# Altium schematic sheet Power.SchDoc
size A3; SheetNumber: 2; SheetTotal: 3
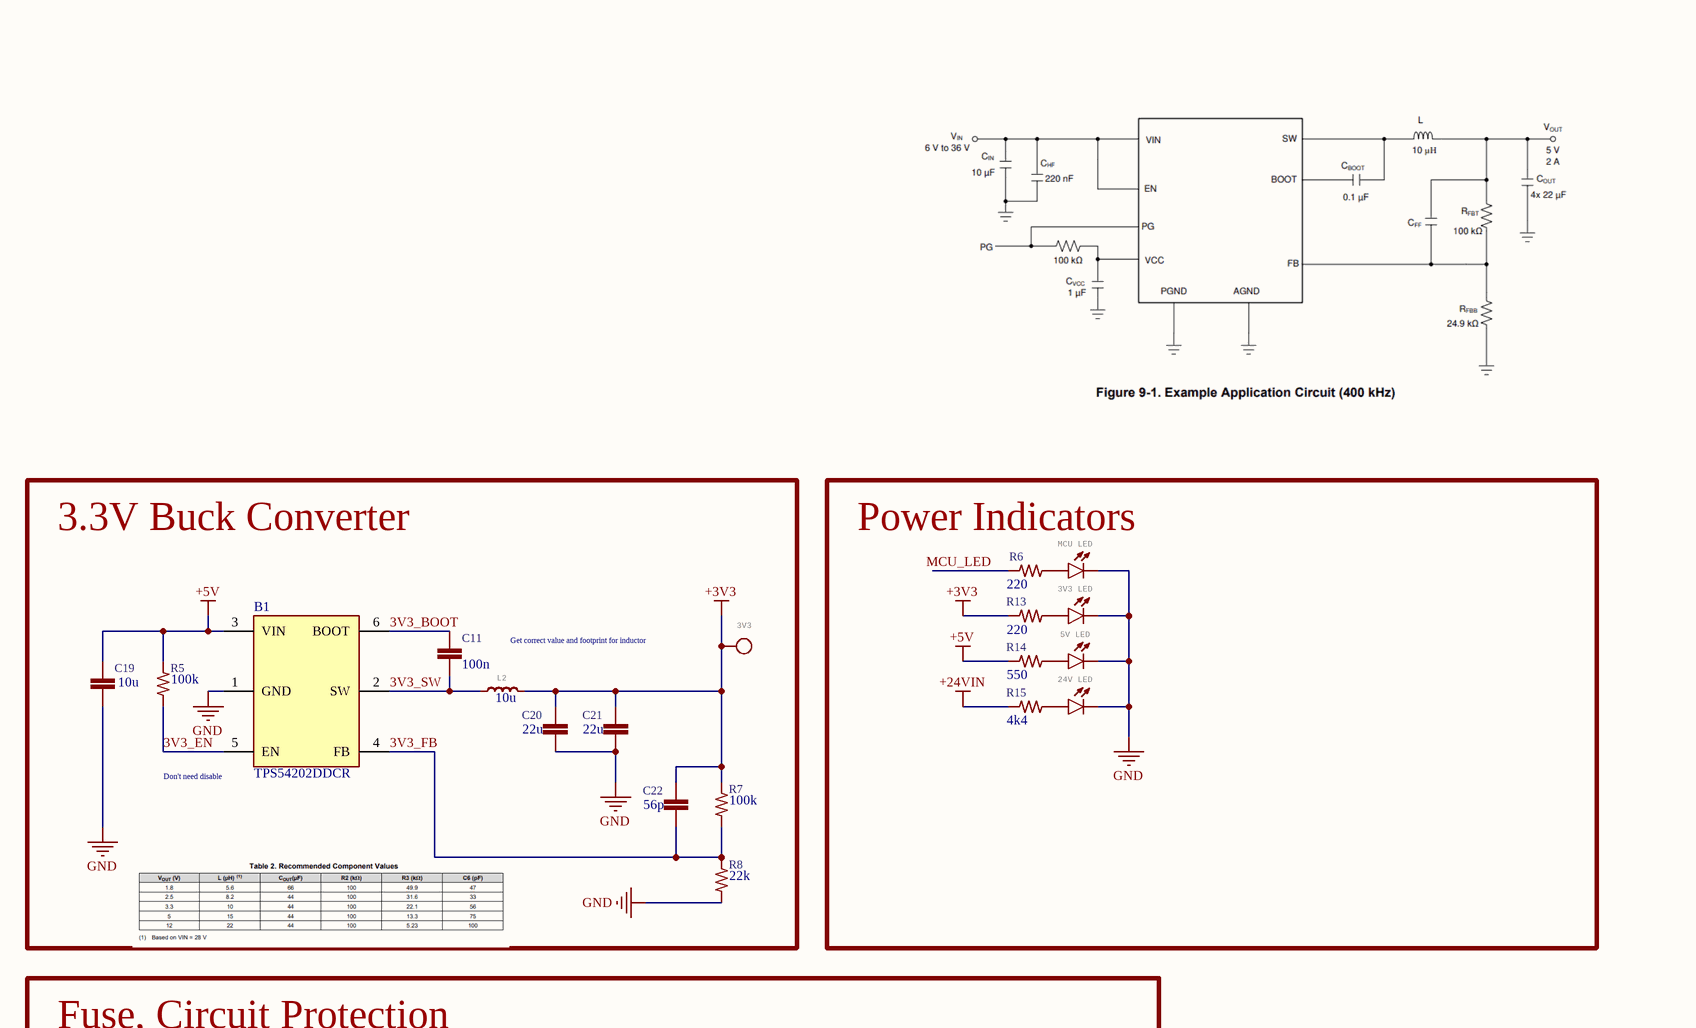
[diagram p0: Power.SchDoc, top middle]
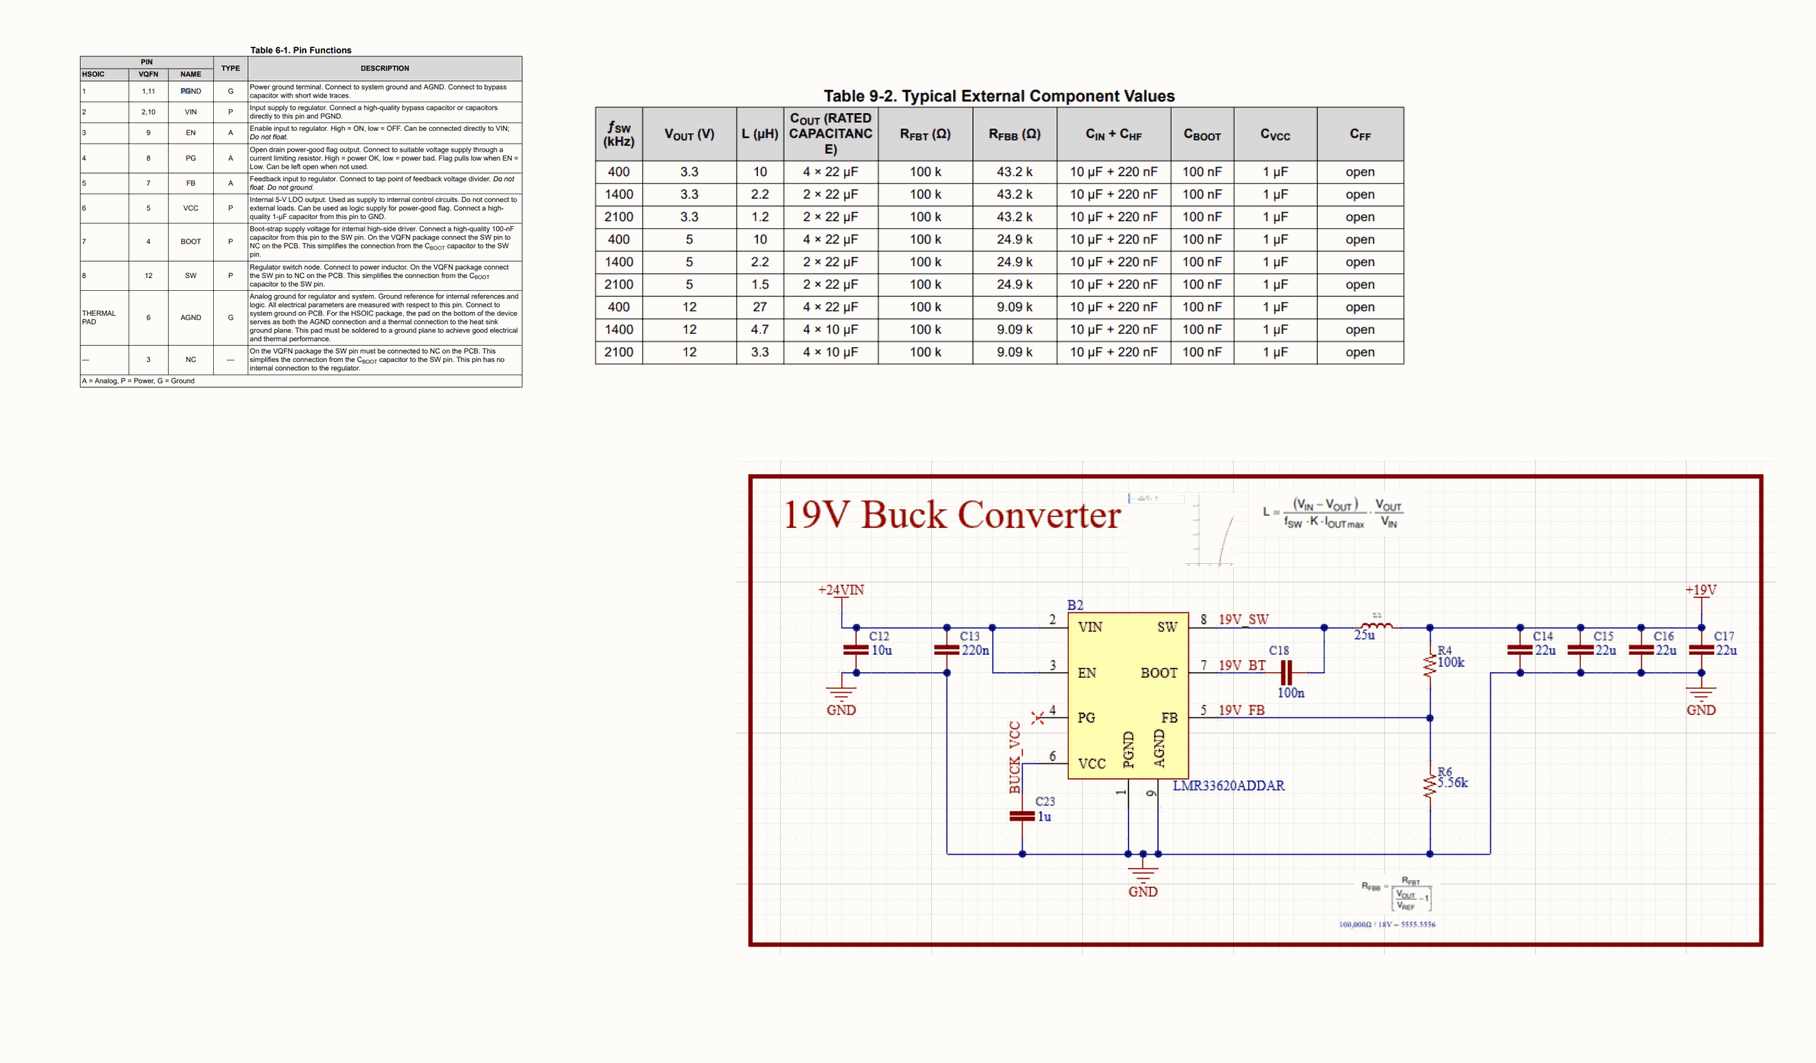
[diagram p1: Power.SchDoc, top right]
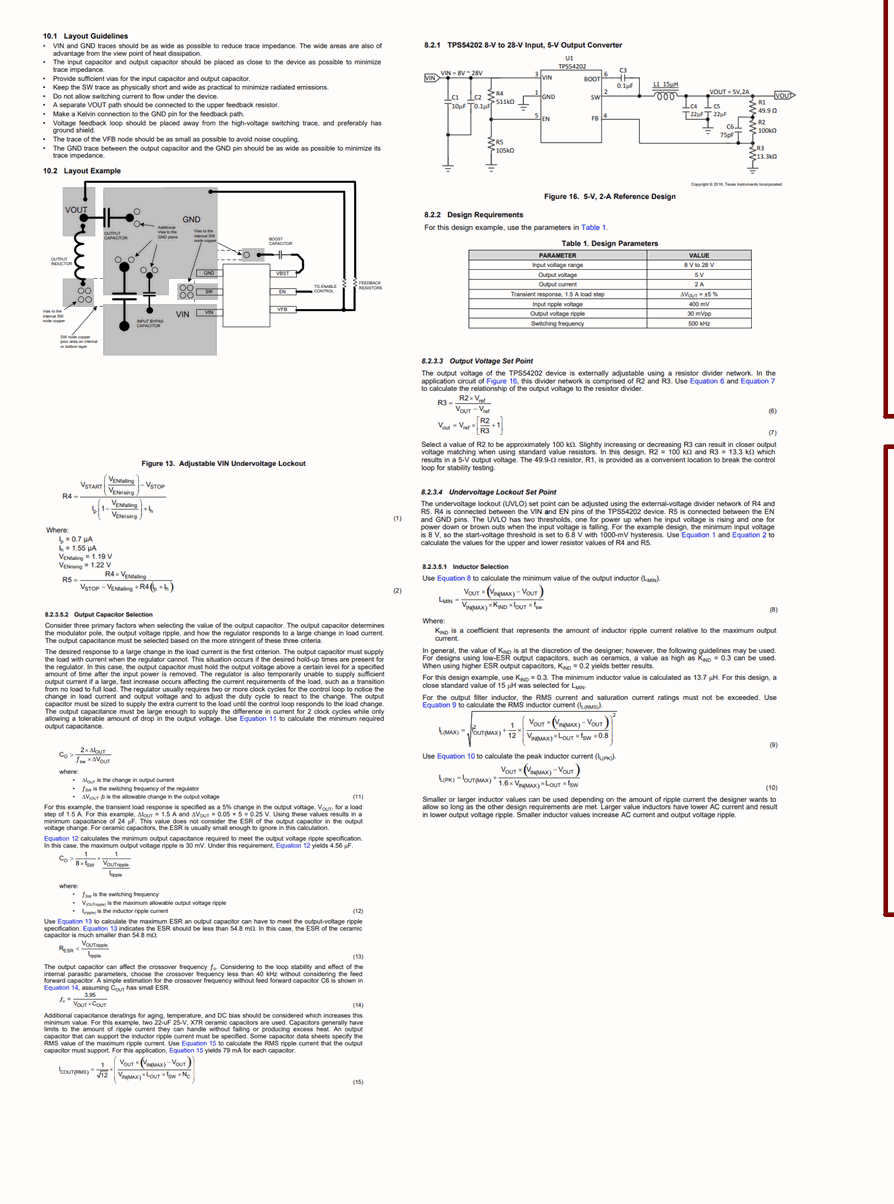
[diagram p2: Power.SchDoc, bottom left]
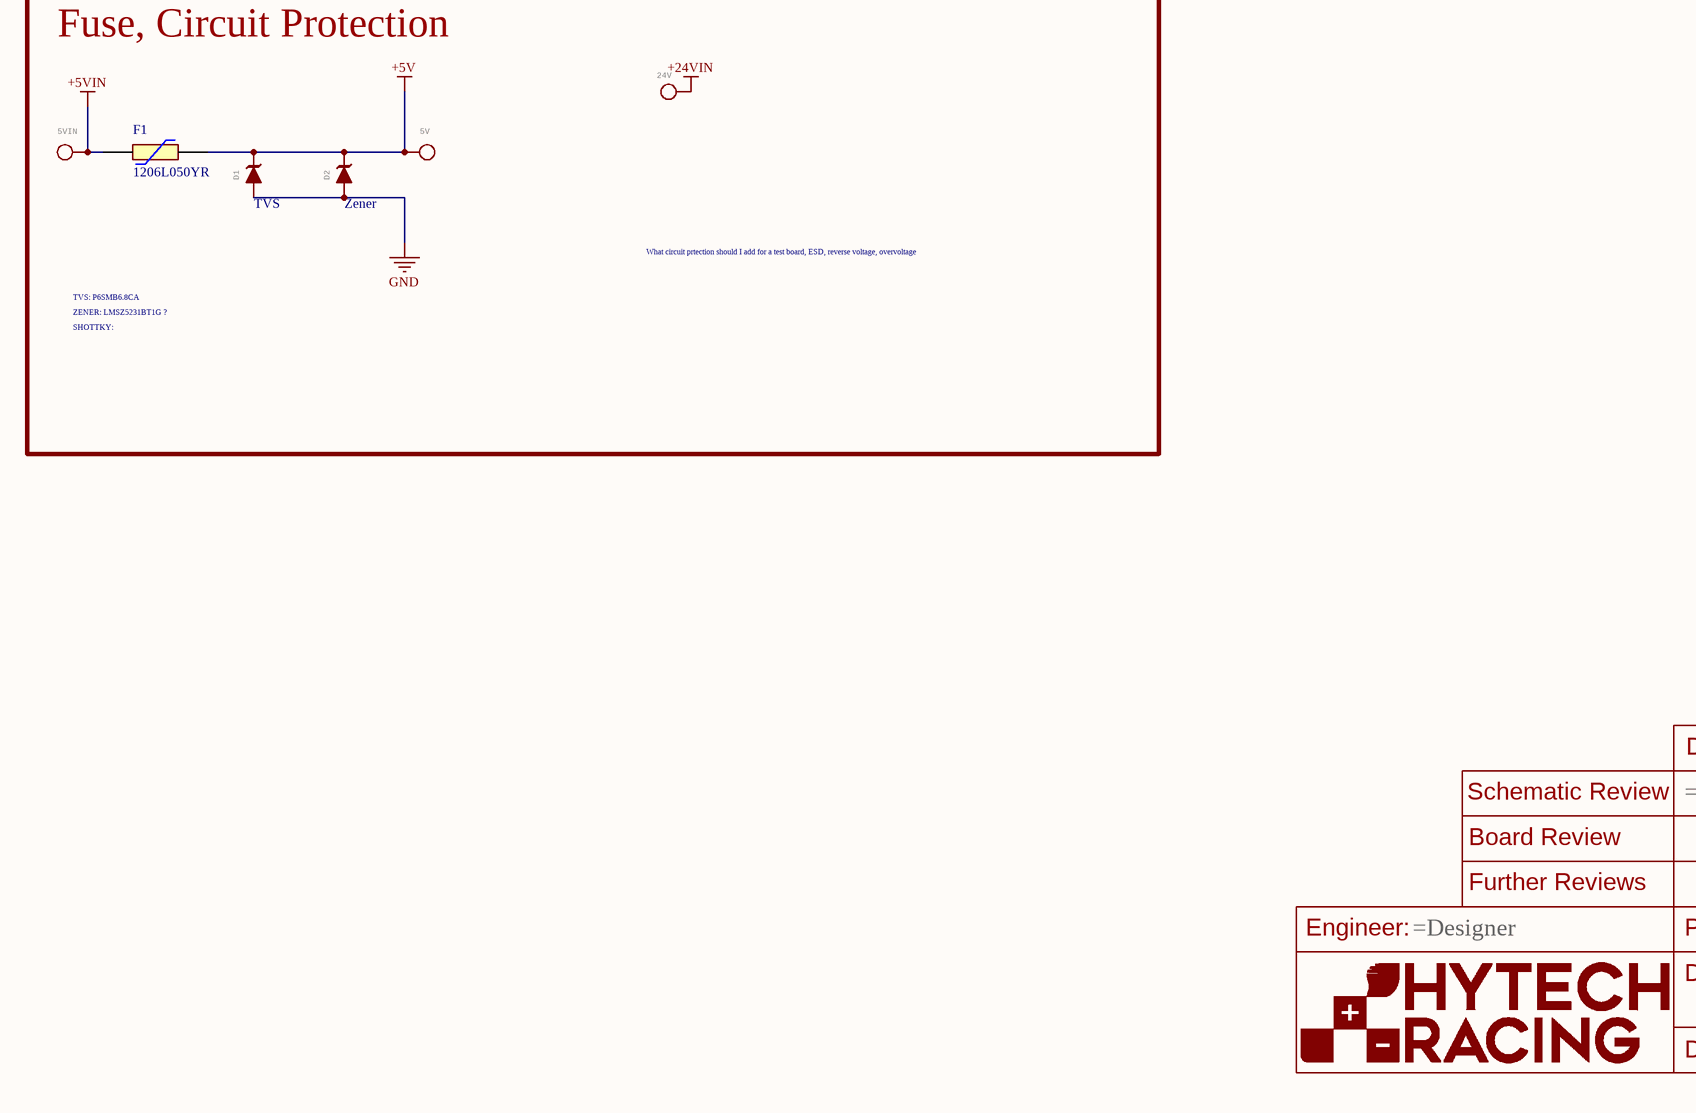
[diagram p3: Power.SchDoc, bottom middle]
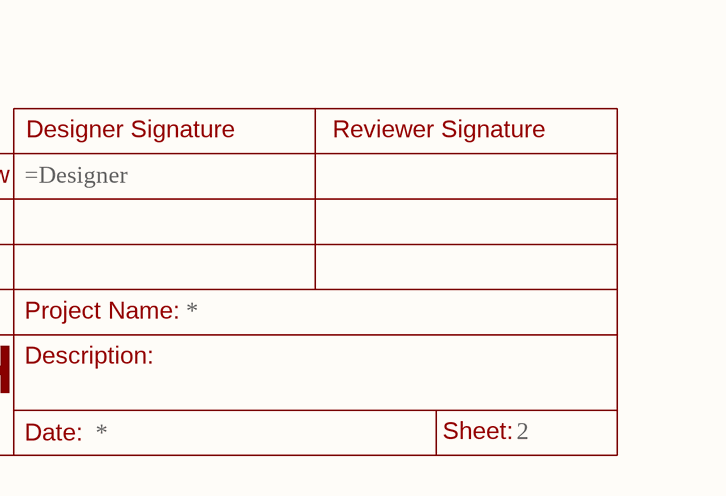
[diagram p4: Power.SchDoc, bottom right]

## Parts
3V3  Test Point for Probing  [5015]  (value not drawn)
3V3_LED  APT1608SGC  [0603-LED]  (value not drawn)
5V  Test Point for Probing  [5015]  (value not drawn)
5V_LED  APT1608SGC  [0603-LED]  (value not drawn)
5VIN  Test Point for Probing  [5015]  (value not drawn)
24V  Test Point for Probing  [5015]  (value not drawn)
24V_LED  APT1608SGC  [0603-LED]  (value not drawn)
B1  TPS54202DDCR  [SOT-23-6]
C11  100n  [0402_CAP]
C19  10u  [0805-CAP]
C20  22u  [1206-CAP]
C21  22u  [1206-CAP]
C22  56p  [1206-CAP]
D1  TVS  [DO-214AA]
D2  Zener  [DO-214AA]
F1  1206L050YR  [1206-FUSE]
FRAME2  HyTech Racing Frame (ANSI Size A)  Prints on US Letter Landscape 8.5" by 11"   Fill Engineer/Description Fields with Text using the following settings:  Size: 0.1  Ratio: 8%  Line Distance: 50%  Font: Proportional  Layer: 94 Symbol  (value not drawn)
L2  10u  [1210_IND]
MCU_LED  APT1608SGC  [0603-LED]  (value not drawn)
R5  100k  [0603-RES]
R6  220  [0603-RES]
R7  100k  [0603-RES]
R8  22k  [0603-RES]
R13  220  [0603-RES]
R14  550  [0603-RES]
R15  4k4  [0603-RES]

## Blocks framed on the sheet
3.3V Buck Converter: 3V3 B1 C11 C19-C22 L2 R5 R7 R8
Power Indicators: 3V3_LED 5V_LED 24V_LED MCU_LED R6 R13-R15
Fuse, Circuit Protection: 5V 5VIN 24V D1 D2 F1

## Nets
+3V3: 3V3.1 C20.1 C21.1 C22.1 L2.2 R7.1 R13.1
+5V: 5V.1 B1.3(VIN) C19.1 D1.2(C) D2.2(C) F1.2 R5.1 R14.1
+5VIN: 5VIN.1 F1.1
+24VIN: 24V.1 R15.1
GND: 3V3_LED.1(C) 5V_LED.1(C) 24V_LED.1(C) B1.1(GND) C19.2 C20.2 C21.2 D1.1(A) D2.1(A) MCU_LED.1(C) R8.2
3V3_BOOT: B1.6(BOOT) C11.2
3V3_EN: B1.5(EN) R5.2
3V3_FB: B1.4(FB) C22.2 R7.2 R8.1
3V3_SW: B1.2(SW) C11.1 L2.1
MCU_LED: R6.1
Net3V3_LED_2: 3V3_LED.2(A) R13.2
Net5V_LED_2: 5V_LED.2(A) R14.2
Net24V_LED_2: 24V_LED.2(A) R15.2
NetMCU_LED_2: MCU_LED.2(A) R6.2

## Notes on the sheet
- Get correct value and footprint for inductor
- (near B1) Don't need disable
- TVS: P6SMB6.8CA
- What circuit prtection should I add for a test board, ESD, reverse voltage, overvoltage
- ZENER: LMSZ5231BT1G ?
- SHOTTKY:
- (in symbol FRAME) Designer Signature; Reviewer Signature; Schematic Review; Board Review; Further Reviews; Engineer:; Project Name:; Description:; Date:; Sheet:

## Library data of the parts
3V3 5V 5VIN 24V = TEST_POINT: MANUFACTURER: Keystone Electronics; GateName_1: G$1; DKPN: 36-5015CT-ND; MOPN: 534-5015; SymbolName_1: TEST_POINT; LibraryName: HyTechDevices; DeviceSetName: TEST_POINT; Package: 5015; MPN: 5015
3V3_LED 5V_LED 24V_LED MCU_LED = LED_?_*0603: MANUFACTURER: Kingbright; MPN: APT1608VBC/D; MPN: APT1608ZGCK; MPN: APT1608SECK; MPN: APT1608SECK/J3-PRV; MANUFACTURER: Bivar Inc.; MPN: SM0603UWC; MPN: APT1608SYCK/J3-PRV; GateName_1: LED; SymbolName_1: DIODE_LED; DeviceName: 0603; DKPN: 754-1789-1-ND; MOPN: 604-APT1608VBC/D; DKPN: 754-1790-1-ND; MOPN: 604-APT1608ZGCK; DKPN: 754-1120-1-ND; MOPN: 604-APT1608SECK; DKPN: 754-1786-1-ND; MOPN: 604-APT1608SECKJ3PRV; DKPN: SM0603UWC-ND; MOPN: 749-SM0603UWC; DKPN: 754-1788-1-ND; MOPN: 604-APT1608SYCK/J3-PRV; LibraryName: HyTechDevices; DeviceSetName: LED_?_*; Package: 0603-LED; COLOR: Blue; COLOR: Green; COLOR: Orange; COLOR: Red; COLOR: White; COLOR: Yellow
B1 = TPS54202DDCR: 4.5V to 28V Input, 2A Output, EMI Friendly Synchronous Step-Down Converter; Manufacturer_Name: Texas Instruments; Geometry.Height: 1.1mm; Mouser Part Number: 595-TPS54202DDCR; Mouser Price/Stock: https://www.mouser.co.uk/ProductDetail/Texas-Instruments/TPS54202DDCR?qs=uP22XH7NdCsJtN%2Fq54jCtQ%3D%3D; Manufacturer_Part_Number: TPS54202DDCR; Datasheet Link: http://www.ti.com/lit/gpn/tps54202
C11 = CAPACITOR_?_*0402: MANUFACTURER: Yageo; MPN: CC0603KRX7R0BB104; MPN: CC0603KRX7R0BB103; MANUFACTURER: KEMET; MPN: C0603C823K8RACTU; MANUFACTURER: Vishay Vitramon; MPN: VJ0603Y104JXQPW1BC; MPN: VJ0603Y224JXQCW1BC; MPN: CC0603KRX7R6BB103; MPN: VJ0603A150FXQPW1BC; MPN: CC0603KRX7R6BB105; MANUFACTURER: Murata Electronics; MPN: GRM188R61A226ME15D; MANUFACTURER: Würth Elektronik; MPN: 885012006016; MPN: 885012206012; MANUFACTURER: Samsung Electro-Mechanics; MPN: CL10A475KP8NNNC; MPN: 885012006013; MPN: C0603C683K8RACTU; MANUFACTURER: Kyocera AVX; MPN: 0201ZA820JAT2A; MPN: CL10B104KA8NNNC; MANUFACTURER: Walsin Technology Corporation; MPN: 0603B224K250CT; MPN: CC0603KRX7R8BB122; MPN: GRM188R61E106MA73D; MPN: CL10B105KA8NNNC; MANUFACTURER: TDK Corporation; MPN: C1608X5R1E475K080AC; MPN: 06033C473K4Z2A; MANUFACTURER: Taiyo Yuden; MPN: GMK107B7104KAHT; MPN: C1608X7R1V224K080AB; MPN: C1608X7R1V105K080AE; MPN: CC0603KRX7R9BB104; MPN: C1608C0G1H103J080AA; MPN: UMK107BJ105KA-T; MPN: CL10B471JB8NNNC; GateName_1: G$1; DeviceName: 0603; CAPACITANCE: 0.1µF; DKPN: 311-1523-1-ND; MOPN: 603-CC603KRX7R0BB104; TOLERANCE: 10%; VOLTAGE: 100V; CAPACITANCE: 10nF; DKPN: 311-1788-1-ND; MOPN: 603-CC603KRX7R0BB103; CAPACITANCE: 0.082µF; DKPN: 399-17417-2-ND; MOPN: 80-C0603C823K8R; VOLTAGE: 10V; DKPN: 720-1688-1-ND; MOPN: 77-VJ0603Y104JXQPBC; TOLERANCE: 5%; CAPACITANCE: 0.22µF; DKPN: 720-VJ0603Y224JXQCW1BCTR-ND; MOPN: 77-VJ0603Y224JXQCBC; DKPN: 311-4054-1-ND; MOPN: 603-CC603KRX7R6BB103; CAPACITANCE: 15pF; DKPN: 720-VJ0603A150FXQPW1BCCT-ND; MOPN: 77-VJ0603A150FXQPBC; TOLERANCE: 1%; CAPACITANCE: 1µF; DKPN: 311-1796-1-ND; MOPN: 603-CC603KRX7R6BB105; CAPACITANCE: 22µF; DKPN: 490-10476-1-ND; MOPN: 81-GRM188R61A226ME5D; TOLERANCE: 20%; CAPACITANCE: 3.3nF; DKPN: 732-7759-1-ND; MOPN: 710-885012006016; CAPACITANCE: 4.7nF; DKPN: 732-7931-1-ND; MOPN: 710-885012206012; CAPACITANCE: 4.7µF; DKPN: 1276-1044-1-ND; MOPN: 187-CL10A475KP8NNNC; CAPACITANCE: 680pF; DKPN: 732-7757-1-ND; MOPN: 710-885012006013; CAPACITANCE: 68nF; DKPN: 399-C0603C683K8RAC7867CT-ND; MOPN: 80-C0603C683K8R; CAPACITANCE: 82pF; DKPN: 478-1025-1-ND; MOPN: 581-0201ZA820JAT2A; DKPN: 1276-1006-1-ND; MOPN: 187-CL10B104KA8NNNC; VOLTAGE: 25V; DKPN: 1292-1420-1-ND; MOPN: 791-0603B224K250CT; CAPACITANCE: 1.2nF; DKPN: 311-4079-2-ND; MOPN: 603-CC603KRX7R8BB122; CAPACITANCE: 10µF; DKPN: 490-7202-1-ND; MOPN: 81-GRM188R61E106MA3D; DKPN: 1276-1184-1-ND; MOPN: 187-CL10B105KA8NNNC; CAPACITANCE: 4.7uF; DKPN: 445-9050-1-ND; MOPN: 810-C1608X5R1E475K; CAPACITANCE: 47nF; DKPN: 478-6340-1-ND; MOPN: 581-06033C473K42ZA; DKPN: 587-3354-1-ND; MOPN: 963-GMK107B7104KAHT; VOLTAGE: 35V; DKPN: 445-14239-1-ND; MOPN: 810-C1608X7R1V224K0B; DKPN: 445-173625-1-ND; MOPN: 810-C1608X7R1V105KAE; DKPN: 311-1344-1-ND; MOPN: 603-CC603KRX7R9BB104; VOLTAGE: 50V; DKPN: 445-7404-1-ND; MOPN: 810-C1608C0G1H103J; CAPACITANCE: 1uF; DKPN: 587-2400-2-ND; MOPN: 963-UMK107BJ105KA-T; CAPACITANCE: 470pF; DKPN: 1276-2058-1-ND; MOPN: 187-CL10B471JB8NNNC; CAPACITANCE: 47pF; DKPN: 445-12417-1-ND; MOPN: CGA3E2NP01H470J080AA; SymbolName_1: CAPACITOR; LibraryName: HyTechDevices; DeviceSetName: CAPACITOR_?_*; Package: 0603-CAP; MANUFACTURER: YAGEO; MPN: CGA3E2NP01H470J080AA
C19 = CAPACITOR_?_*0805: MANUFACTURER: KEMET; MPN: C0805C224K1RACTU; MANUFACTURER: Yageo; MPN: CC0805MKX5R8BB226; MANUFACTURER: Murata; MPN: GRM21BR61H106KE43L; GateName_1: G$1; DeviceName: 0805; CAPACITANCE: 0.22µF; DKPN: 399-8049-1-ND; MOPN: 80-C0805C224K1R; TOLERANCE: 10%; VOLTAGE: 100V; CAPACITANCE: 22µF; DKPN: 311-1903-1-ND; MOPN: 603-CC805MKX5R8BB226; TOLERANCE: 20%; VOLTAGE: 25V; CAPACITANCE: 10uF; DKPN: 490-18663-2-ND; MOPN: 81-GRM21BR61H106KE3L; VOLTAGE: 50V; SymbolName_1: CAPACITOR; LibraryName: HyTechDevices; DeviceSetName: CAPACITOR_?_*; Package: 0805-CAP
C20-C22 = CAPACITOR_?_*1206: MANUFACTURER: AVX Corporation; MPN: 12061C225K4T2A; MANUFACTURER: TDK Corporation; MPN: C3216X7R2E104K160AM; MPN: C3216X5R1E336M160AC; MPN: C3216X5R1V226M160AC; GateName_1: G$1; DeviceName: 1206; CAPACITANCE: 2.2µF; DKPN: 478-12144-1-ND; MOPN: 581-12061C225K4T2A; TOLERANCE: 10%; VOLTAGE: 100V; CAPACITANCE: 0.1μF; DKPN: 445-6079-2-ND; MOPN: 810-C3216X7R2E104KT5; VOLTAGE: 250V; CAPACITANCE: 33µF; DKPN: 445-8046-1-ND; MOPN: 810-C3216X5R1E336M; TOLERANCE: 20%; VOLTAGE: 25V; CAPACITANCE: 22µF; DKPN: 445-8045-1-ND; MOPN: 810-C3216X5R1V226M; VOLTAGE: 35V; SymbolName_1: CAPACITOR; LibraryName: HyTechDevices; DeviceSetName: CAPACITOR_?_*; Package: 1206-CAP
D1 = TVS_?_*DO-214AA: P6SMB6.8CA; MANUFACTURER: Bourns Inc.; MPN: 1.5SMBJ28A; MPN: 1.5SMBJ30A; GateName_1: G$1; SymbolName_1: DIODE_TVS_UNIDIRECTIONAL; DKPN: 118-1.5SMBJ28ATR-ND; MOPN: 652-1.5SMBJ28A; VOLTAGE: 28V; DKPN: 118-1.5SMBJ30ATR-ND; MOPN: 652-1.5SMBJ30A; VOLTAGE: 30V; DeviceName: DO-214AA; LibraryName: HyTechDevices; DeviceSetName: TVS_?_*; Package: DO-214AA
D2 = TVS_?_*DO-214AA: CZRB5338B-HF; MANUFACTURER: Bourns Inc.; MPN: 1.5SMBJ28A; MPN: 1.5SMBJ30A; GateName_1: G$1; SymbolName_1: DIODE_TVS_UNIDIRECTIONAL; DKPN: 118-1.5SMBJ28ATR-ND; MOPN: 652-1.5SMBJ28A; VOLTAGE: 28V; DKPN: 118-1.5SMBJ30ATR-ND; MOPN: 652-1.5SMBJ30A; VOLTAGE: 30V; DeviceName: DO-214AA; LibraryName: HyTechDevices; DeviceSetName: TVS_?_*; Package: DO-214AA
F1 = FUSE_RESETTABLE_1206: Resettable POLYFUSE 100A 6V Littelfuse 0.5A Surface Mount Resettable Fuse, 6 V dc; Geometry.Height: 0.75mm; Mouser Part Number: 576-1206L050YR; Mouser Price/Stock: https://www.mouser.co.uk/ProductDetail/Littelfuse/1206L050YR?qs=PWhpLWeW8wckT8hV5jLiAA%3D%3D; Manufacturer_Name: LITTELFUSE; Manufacturer_Part_Number: 1206L050YR; Datasheet Link: https://m.littelfuse.com/~/media/electronics/datasheets/resettable_ptcs/littelfuse_ptc_1206l_datasheet.pdf.pdf
FRAME2 = FRAME: GateName_1: O; SymbolName_1: FRAME; LibraryName: HyTechFrames; DeviceSetName: FRAME
L2 = INDUCTOR_1210: MANUFACTURER: Wurth Elektronik; MPN: 74437349560; GateName_1: G$1; DeviceName: WELMHI; DeviceSetName: INDUCTOR_?_*; CURRENT_RATED: 1.4A; CURRENT_SATURATION: 2A; DCR: 342mΩ; DKPN: 732-11454-2-ND; INDUCTANCE: 56µH; MOPN: 710-74437349560; TOLERANCE: 20%; SymbolName_1: INDUCTOR; LibraryName: HyTechDevices; Package: WE-LMHI
R5 R7 = RESISTOR_?_*0603: MANUFACTURER: Yageo; MPN: RC0603FR-070RL; MANUFACTURER: Panasonic Electronic Components; MPN: ERJ-3BWFR020V; MPN: RL0603FR-070R5L; MPN: ERJ-3EKF1131V; MANUFACTURER: Vishay Dale; MPN: CRCW06031M13FKEA; MPN: RC0603FR-071K24L; MPN: ERA-3AEB1331V; MPN: RC0603FR-071M5L; MANUFACTURER: TE Conductivity Passive Product; MPN: CPF0603B1R62E1; MPN: RC0603FR-071K65L; MPN: RC0603FR-0710RL; MPN: ERA-3AEB1022V; MPN: ERA-3AEB1052V; MPN: RC0603FR-07100RL; MPN: RC0603FR-07100KL; MPN: ERA-3ARB103V; MPN: ERA-3AEB1132V; MPN: ERA-3AEB1152V; MPN: ERJ-PB3B1242V; MPN: ERA-3AEB121V; MPN: RC0603FR-0712KL; MPN: ERJ-1GNF13R0C; MPN: ERJ-PB3B1332V; MPN: ERA-3ARW133V; MPN: RT0603BRB0714KL; MPN: CRCW060315R0FKEAHP; MPN: ERA-3AEB154V; MPN: ERA-3AEB1543V; MPN: ERA-3ARB153V; MPN: RC0603FR-0717K8L; MPN: RC0603FR-0718K7L; MPN: RC0603FR-07180RL; MANUFACTURER: TE Connectivity Passive Product; MPN: CPF-A-0603B1K0E; MPN: RC0603FR-071ML; MPN: RT0805BRD072K18L; MPN: RC0603FR-072K55L; MPN: ERJ-PB3B2741V; MPN: RC0603FR-0720KL; MPN: ERJ-PB3B2100V; MPN: ERA-3AEB2153V; MPN: RC0603FR-0722RL; MPN: ERA-3AEB2212V; MPN: RC0603FR-07240RL; MANUFACTURER: Panasonic Electronic Company; MPN: ERA-3AEB2553V; MPN: ERJ-UP3F2001V; MPN: ERJ-3RQF3R3V; MPN: RT0603BRD073K32L; MPN: ERJ-PB3D3301V; MPN: RC0603FR-073K9L; MPN: ERJ-PB3B3092V; MPN: ERA-3ARB303V; MPN: ERJ-PB3B3322V; MPN: ERA-3AEB334V; MANUFACTURER: Rohm Semiconductor; MPN: KTR03EZPF3302; MPN: RC0603FR-0736K5L; MPN: RC0603FR-07360RL; MPN: KTR03EZPF3603; MPN: RC0603FR-07374KL; MPN: RT0603BRD0739RL; MPN: ERA-3AEB4121V; MPN: RC0603FR-074K64L; MPN: RC0603FR-07402RL; MPN: ERJ-1GNF41R2C; MPN: ERJ-PB3B4122V; MPN: RC0603FR-0743KL; MPN: ERJ-PA3F4700V; MPN: ERJ-P03J5R1V; MPN: RC0603FR-075K1L; MPN: RN73C1J5R49BTD; MPN: ERJ-PB3D5491V; MPN: ERA-3AEB5901V; MPN: RT0603BRE0750RL; MPN: KTR03EZPF5103; MPN: RC0603FR-0760R4L; MPN: RC0603FR-07620RL; MPN: ERA-3AEB7322V; MPN: RT0603BRE0775KL; MANUFACTURER: Vishay Dale Thin Film; MPN: PTN0603E8351BST1; MPN: RT0603BRD078K66L; MPN: ERA-3AEB8452V; MPN: ERJ-PB3B9312V; MANUFACTURER: Rohm; MPN: KTR03EZPF3301; MPN: KTR03EZPF7502; MPN: KTR03EZPF7503; GateName_1: G$1; DeviceName: 0603; DKPN: 311-0.0HRCT-ND; MOPN: 603-RC0603FR-070RL; POWER: 0.1W; RESISTANCE: 0; TOLERANCE: 1%; VOLTAGE_CONTINUOUS: 75V; DKPN: P17461CT-ND; MOPN: 667-ERJ-3BWFR020V; POWER: 0.33W; RESISTANCE: 0.02; VOLTAGE_CONTINUOUS: 0.081V; VOLTAGE_MAX: 150V; DKPN: 311-.5QTR-ND; MOPN: 603-RL0603FR070R5L; RESISTANCE: 0.5; VOLTAGE_CONTINUOUS: 0.22V; DKPN: P1.13KHCT-ND; MOPN: 667-ERJ-3EKF1131V; RESISTANCE: 1.13k; DKPN: 541-1.13MHCT-ND; MOPN: 71-CRCW06031M13FKEA; RESISTANCE: 1.13M; VOLTAGE_MAX: 100V; DKPN: 311-1.24KHRCT-ND; MOPN: 603-RC0603FR-071K24L; RESISTANCE: 1.24k; VOLTAGE_CONTINUOUS: 11.14V; DKPN: P1.33KDBCT-ND; MOPN: 667-ERA-3AEB1331V; RESISTANCE: 1.33k; TOLERANCE: 0.1%; VOLTAGE_CONTINUOUS: 11.53V; DKPN: 311-1.50MHRCT-ND; MOPN: 603-RC0603FR-071M5L; RESISTANCE: 1.5M; DKPN: 1712-CPF0603B1R62E1TR-ND; MOPN: 279-CPF0603B1R62E1; RESISTANCE: 1.62; VOLTAGE_CONTINUOUS: 0.51V; VOLTAGE_MAX: 50V; DKPN: 311-1.65KHRCT-ND; MOPN: 603-RC0603FR-071K65L; RESISTANCE: 1.65k; VOLTAGE_CONTINUOUS: 12.85V; DKPN: 311-10.0HRCT-ND; MOPN: 603-RC0603FR-0710RL; RESISTANCE: 10; VOLTAGE_CONTINUOUS: 1.00V; DKPN: P10.2KDBCT-ND; MOPN: 667-ERA-3AEB1022V; RESISTANCE: 10.2k; VOLTAGE_CONTINUOUS: 31.94V; DKPN: P10.5KDBCT-ND; MOPN: 677-ERA-3AEB1052V; RESISTANCE: 10.5k; VOLTAGE_CONTINUOUS: 32.40V; DKPN: 311-100HRCT-ND; MOPN: 603-RC0603FR-07100RL; RESISTANCE: 100; VOLTAGE_CONTINUOUS: 3.16V; DKPN: 311-100KHRTR-ND; MOPN: 603-RC0603FR-07100KL; DKPN: P10KBDCT-ND; MOPN: 667-ERA-3ARB103V; RESISTANCE: 10k; VOLTAGE_CONTINUOUS: 31.62V; DKPN: P11.3KDBCT-ND; MOPN: 667-ERA-3AEB1132V; RESISTANCE: 11.3k; VOLTAGE_CONTINUOUS: 33.62V; DKPN: P11.5KDBCT-ND; MOPN: 667-ERA-3AEB1152V; RESISTANCE: 11.5k; VOLTAGE_CONTINUOUS: 33.91V; DKPN: P20096CT-ND; MOPN: 667-ERJ-PB3B1242V; POWER: 0.2W; RESISTANCE: 12.4k; VOLTAGE_CONTINUOUS: 49.79V; DKPN: P120DBCT-ND; MOPN: 667-ERA-3AEB121V; RESISTANCE: 120; VOLTAGE_CONTINUOUS: 3.46V; DKPN: 311-12.0KHRCT-ND; MOPN: 603-RC0603FR-0712KL; RESISTANCE: 12k; VOLTAGE_CONTINUOUS: 34.64V; DKPN: P122724CT-ND; MOPN: 667-ERJ-1GNF13R0C; POWER: 0.05W; RESISTANCE: 13; VOLTAGE_CONTINUOUS: 25V; DKPN: P20099TR-ND; MOPN: 667-ERJ-PB3B1332V; RESISTANCE: 13.3k; VOLTAGE_CONTINUOUS: 51.58V; VOLTAGE_MAX: 75k; DKPN: P13KBECT-ND; MOPN: 667-ERA-3ARW133V; RESISTANCE: 13k; TOLERANCE: 0.05%; DKPN: RT0603BRB0714KL-ND; MOPN: 603-RT0603BRB0714KL; RESISTANCE: 14k; VOLTAGE_CONTINUOUS: 37.4V; DKPN: 541-15.0STR-ND; MOPN: 71-CRCW060315R0FKEAH; RESISTANCE: 15; VOLTAGE_CONTINUOUS: 2.22V; DKPN: P150KDBCT-ND; MOPN: 667-ERA-3AEB154V; RESISTANCE: 150k; DKPN: P154KDBCT-ND; MOPN: 667-ERA-3AEB1543V; RESISTANCE: 154k; DKPN: P15KBDCT-ND; MOPN: 667-ERA-3ARB153V; RESISTANCE: 15k; VOLTAGE_CONTINUOUS: 38.73V; DKPN: 311-17.8KHRCT-ND; MOPN: 603-RC0603FR-0717K8L; RESISTANCE: 17.8k; VOLTAGE_CONTINUOUS: 42.19V; DKPN: 311-18.7KHRCT-ND; MOPN: 603-RC0603FR-0718K7L; RESISTANCE: 18.7k; VOLTAGE_CONTINUOUS: 43.24V; DKPN: 311-180HRCT-ND; MOPN: 603-RC0603FR-07180RL; RESISTANCE: 180; VOLTAGE_CONTINUOUS: 4.24V; DKPN: 1712-CPF-A-0603B1K0ETR-ND; MOPN: 279-CPF-A-0603B1K0E; POWER: 0.0625W; RESISTANCE: 1k; VOLTAGE_CONTINUOUS: 7.9V; DKPN: 311-1.00MHRCT-ND; MOPN: 603-RC0603FR-071ML; RESISTANCE: 1M; DKPN: 13-RT0805BRD072K18LTR-ND; MOPN: 603-RT0805BRD072K18L; POWER: 0.125W; RESISTANCE: 2.18k; VOLTAGE_CONTINUOUS: 16.51V; DKPN: 311-2.55KHRCT-ND; MOPN: 603-RC0603FR-072K55L; RESISTANCE: 2.55k; VOLTAGE_CONTINUOUS: 15.97V; DKPN: P20020CT-ND; MOPN: 667-ERJ-PB3B2741V; RESISTANCE: 2.74k; VOLTAGE_CONTINUOUS: 23.41V; DKPN: 311-20.0KHRTR-ND; MOPN: 603-RC0603FR-0720KL; POWER: 0.1 W; RESISTANCE: 20k; VOLTAGE_CONTINUOUS: 44.72V; DKPN: P19892CT-ND; MOPN: 667-ERJ-PB3B2100V; RESISTANCE: 210; VOLTAGE_CONTINUOUS: 6.48V; DKPN: P215KDBCT-ND; MOPN: 667-ERA-3AEB2153V; RESISTANCE: 215k; DKPN: 311-22.0HRCT-ND; MOPN: 603-RC0603FR-0722RL; RESISTANCE: 22; VOLTAGE_CONTINUOUS: 1.48V; DKPN: P22.1KDBCT-ND; MOPN: 667-ERA-3AEB2212V; RESISTANCE: 22.1k; VOLTAGE_CONTINUOUS: 47.01V; DKPN: 311-240HRCT-ND; MOPN: 603-RC0603FR-07240RL; RESISTANCE: 240; VOLTAGE_CONTINUOUS: 4.90V; DKPN: P255KDBCT-ND; MOPN: 667-ERA-3AEB2553V; RESISTANCE: 255k; DKPN: 10-ERJ-UP3F2001VTR-ND; MOPN: 667-ERJ-UP3F2001V; POWER: 0.25W; RESISTANCE: 2k; VOLTAGE_CONTINUOUS: 22.36V; DKPN: P3.3AJTR-ND; MOPN: 667-ERJ-3RQF3R3V; RESISTANCE: 3.3; VOLTAGE_CONTINUOUS: 0.57V; DKPN: YAG1651TR-ND; MOPN: 603-RT0603BRD073K32L; RESISTANCE: 3.32k; VOLTAGE_CONTINUOUS: 18.22V; DKPN: P20340TR-ND; MOPN: 667-ERJ-PB3D3301V; POWER: 0.3W; RESISTANCE: 3.3k; TOLERANCE: 0.5%; VOLTAGE_CONTINUOUS: 25.69V; VOLTAGE_MAX: 150; DKPN: 311-3.90KHRCT-ND; MOPN: 603-RC0603FR-073K9L; RESISTANCE: 3.9k; VOLTAGE_CONTINUOUS: 19.75V; DKPN: P20140CT-ND; MOPN: 667-ERJ-PB3B3092V; RESISTANCE: 30.9k; VOLTAGE_MAX: 200V; DKPN: P30KBDCT-ND; MOPN: 667-ERA-3ARB303V; RESISTANCE: 30k; VOLTAGE_CONTINUOUS: 54.77V; DKPN: P20144TR-ND; MOPN: 667-ERJ-PB3B3322V; RESISTANCE: 33.2k; VOLTAGE_CONTINUOUS: 57.61V; DKPN: P330KDBCT-ND; MOPN: 667-ERA-3AEB334V; RESISTANCE: 330k; DKPN: RHM33KAYTR-ND; MOPN: 755-KTR03EZPF3302; RESISTANCE: 33k; VOLTAGE_CONTINUOUS: 57.44V; VOLTAGE_MAX: 350V; DKPN: 311-36.5KHRCT-ND; MOPN: 603-RC0603FR-0736K5L; RESISTANCE: 36.5k; VOLTAGE_CONTINUOUS: 60.42V; DKPN: 311-360HRTR-ND; MOPN: 603-RC0603FR-07360RL; RESISTANCE: 360; VOLTAGE_CONTINUOUS: 6.00V; DKPN: RHM360KAYTR-ND; MOPN: 755-KTR03EZPF3603; RESISTANCE: 360k; VOLTAGE_CONTINUOUS: 189.74V; DKPN: 311-374KHRCT-ND; MOPN: 603-RC0603FR-07374KL; RESISTANCE: 374k; DKPN: 13-RT0603BRD0739RLTR-ND; MOPN: 603-RT0603BRD0739RL; RESISTANCE: 39; VOLTAGE_CONTINUOUS: 1.97V; DKPN: P4.12KDBCT-ND; MOPN: 667-ERA-3AEB4121V; RESISTANCE: 4.12k; VOLTAGE_CONTINUOUS: 20.30V; DKPN: 311-4.64KHRCT-ND; MOPN: 603-RC0603FR-074K64L; RESISTANCE: 4.64k; VOLTAGE_CONTINUOUS: 21.54V; DKPN: 311-402HRCT-ND; MOPN: 603-RC0603FR-07402RL; RESISTANCE: 402; VOLTAGE_CONTINUOUS: 6.34V; DKPN: P123000CT-ND; MOPN: 667-ERJ-1GNF41R2C; RESISTANCE: 41.2; DKPN: P20155CT-ND; MOPN: 667-ERJ-PB3B4122V; RESISTANCE: 41.2k; DKPN: 311-43.0KHRCT-ND; MOPN: 603-RC0603FR-0743KL; RESISTANCE: 43k; VOLTAGE_CONTINUOUS: 65.57V; DKPN: P470BYCT-ND; MOPN: 667-ERJ-PA3F4700V; RESISTANCE: 470; VOLTAGE_CONTINUOUS: 10.84V; DKPN: P16039TR-ND; MOPN: 667-ERJ-P03J5R1V; RESISTANCE: 5.1; VOLTAGE_CONTINUOUS: 1.13V; DKPN: 311-5.10KHRTR-ND; MOPN: 603-RC0603FR-075K1L; RESISTANCE: 5.1k; VOLTAGE_CONTINUOUS: 22.58V; DKPN: A124665CT-ND; MOPN: 279-RN73C1J5R49BTD; RESISTANCE: 5.49; DKPN: P20367CT-ND; MOPN: 667-ERJ-PB3D5491V; RESISTANCE: 5.49k; DKPN: P5.9KDBCT-ND; MOPN: 667-ERA-3AEB5901V; RESISTANCE: 5.9k; VOLTAGE_CONTINUOUS: 24.29V; DKPN: 13-RT0603BRE0750RLCT-ND; MOPN: 603-RT0603BRE0750RL; RESISTANCE: 50; VOLTAGE_CONTINUOUS: 2.24V; DKPN: RHM510KAYTR-ND; MOPN: 755-KTR03EZPF5103; RESISTANCE: 510k; VOLTAGE_CONTINUOUS: 225.83V; DKPN: 311-60.4HRCT-ND; MOPN: 603-RC0603FR-0760R4L; RESISTANCE: 60.4; VOLTAGE_CONTINUOUS: 2.48V; DKPN: 311-620HRCT-ND; MOPN: 603-RC0603FR-07620RL; RESISTANCE: 620; VOLTAGE_CONTINUOUS: 7.87V; DKPN: P73.2KDBCT-ND; MOPN: 667-ERA-3AEB7322V; RESISTANCE: 73.2k; DKPN: RT0603BRE0775KL-ND; MOPN: 603-RT0603BRE0775KL; DKPN: 764-1461-2-ND; MOPN: 71-PTN0603E8351BST1; POWER: 0.15W; RESISTANCE: 8.35k; VOLTAGE_CONTINUOUS: 28.90V; DKPN: YAG4603TR-ND; MOPN: 603-RT0603BRD078K66L; RESISTANCE: 8.66k; VOLTAGE_CONTINUOUS: 29.43V; DKPN: P84.5KDBCT-ND; MOPN: 667-ERA-3AEB8452V; RESISTANCE: 84.5k; DKPN: P20197CT-ND; MOPN: 667-ERJ-PB3B9312V; RESISTANCE: 93.1k; VOLTAGE_CONTINUOUS: 136V; RESISTANCE: DNP; DKPN: RHM3.3KAYTR-ND; MOPN: 755-KTR03EZPF3301; VOLTAGE_CONTINUOUS: 18.17V; DKPN: RHM75KAYTR-ND; MOPN: 755-KTR03EZPF7502; RESISTANCE: 750k; VOLTAGE_CONTINUOUS: 273.86V; DKPN: RHM750KAYTR-ND; MOPN: 755-KTR03EZPF7503; VOLTAGE_CONTINUOUS: 86.60V; SymbolName_1: RESISTOR; LibraryName: HyTechDevices; DeviceSetName: RESISTOR_?_*; Package: 0603-RES; VOLTAGE_MAX: 75V; RESISTANCE: 100k; MANUFACTURER: YAGEO; VOLTAGE_CONTINUOUS: 150V; VOLTAGE_CONTINUOUS: 50V; RESISTANCE: 75k
R6 R8 R13-R15 = RESISTOR_?_*0603: MANUFACTURER: Yageo; MPN: RC0603FR-070RL; MANUFACTURER: Panasonic Electronic Components; MPN: ERJ-3BWFR020V; MPN: RL0603FR-070R5L; MPN: ERJ-3EKF1131V; MANUFACTURER: Vishay Dale; MPN: CRCW06031M13FKEA; MPN: RC0603FR-071K24L; MPN: ERA-3AEB1331V; MPN: RC0603FR-071M5L; MANUFACTURER: TE Conductivity Passive Product; MPN: CPF0603B1R62E1; MPN: RC0603FR-071K65L; MPN: RC0603FR-0710RL; MPN: ERA-3AEB1022V; MPN: ERA-3AEB1052V; MPN: RC0603FR-07100RL; MPN: RC0603FR-07100KL; MPN: ERA-3ARB103V; MPN: ERA-3AEB1132V; MPN: ERA-3AEB1152V; MPN: ERJ-PB3B1242V; MPN: ERA-3AEB121V; MPN: RC0603FR-0712KL; MPN: ERJ-1GNF13R0C; MPN: ERJ-PB3B1332V; MPN: ERA-3ARW133V; MPN: RT0603BRB0714KL; MPN: CRCW060315R0FKEAHP; MPN: ERA-3AEB154V; MPN: ERA-3AEB1543V; MPN: ERA-3ARB153V; MPN: RC0603FR-0717K8L; MPN: RC0603FR-0718K7L; MPN: RC0603FR-07180RL; MANUFACTURER: TE Connectivity Passive Product; MPN: CPF-A-0603B1K0E; MPN: RC0603FR-071ML; MPN: RT0805BRD072K18L; MPN: RC0603FR-072K55L; MPN: ERJ-PB3B2741V; MPN: RC0603FR-0720KL; MPN: ERJ-PB3B2100V; MPN: ERA-3AEB2153V; MPN: RC0603FR-0722RL; MPN: ERA-3AEB2212V; MPN: RC0603FR-07240RL; MANUFACTURER: Panasonic Electronic Company; MPN: ERA-3AEB2553V; MPN: ERJ-UP3F2001V; MPN: ERJ-3RQF3R3V; MPN: RT0603BRD073K32L; MPN: ERJ-PB3D3301V; MPN: RC0603FR-073K9L; MPN: ERJ-PB3B3092V; MPN: ERA-3ARB303V; MPN: ERJ-PB3B3322V; MPN: ERA-3AEB334V; MANUFACTURER: Rohm Semiconductor; MPN: KTR03EZPF3302; MPN: RC0603FR-0736K5L; MPN: RC0603FR-07360RL; MPN: KTR03EZPF3603; MPN: RC0603FR-07374KL; MPN: RT0603BRD0739RL; MPN: ERA-3AEB4121V; MPN: RC0603FR-074K64L; MPN: RC0603FR-07402RL; MPN: ERJ-1GNF41R2C; MPN: ERJ-PB3B4122V; MPN: RC0603FR-0743KL; MPN: ERJ-PA3F4700V; MPN: ERJ-P03J5R1V; MPN: RC0603FR-075K1L; MPN: RN73C1J5R49BTD; MPN: ERJ-PB3D5491V; MPN: ERA-3AEB5901V; MPN: RT0603BRE0750RL; MPN: KTR03EZPF5103; MPN: RC0603FR-0760R4L; MPN: RC0603FR-07620RL; MPN: ERA-3AEB7322V; MPN: RT0603BRE0775KL; MANUFACTURER: Vishay Dale Thin Film; MPN: PTN0603E8351BST1; MPN: RT0603BRD078K66L; MPN: ERA-3AEB8452V; MPN: ERJ-PB3B9312V; MANUFACTURER: Rohm; MPN: KTR03EZPF3301; MPN: KTR03EZPF7502; MPN: KTR03EZPF7503; GateName_1: G$1; DeviceName: 0603; DKPN: 311-0.0HRCT-ND; MOPN: 603-RC0603FR-070RL; POWER: 0.1W; RESISTANCE: 0; TOLERANCE: 1%; VOLTAGE_CONTINUOUS: 75V; DKPN: P17461CT-ND; MOPN: 667-ERJ-3BWFR020V; POWER: 0.33W; RESISTANCE: 0.02; VOLTAGE_CONTINUOUS: 0.081V; VOLTAGE_MAX: 150V; DKPN: 311-.5QTR-ND; MOPN: 603-RL0603FR070R5L; RESISTANCE: 0.5; VOLTAGE_CONTINUOUS: 0.22V; DKPN: P1.13KHCT-ND; MOPN: 667-ERJ-3EKF1131V; RESISTANCE: 1.13k; DKPN: 541-1.13MHCT-ND; MOPN: 71-CRCW06031M13FKEA; RESISTANCE: 1.13M; VOLTAGE_MAX: 100V; DKPN: 311-1.24KHRCT-ND; MOPN: 603-RC0603FR-071K24L; RESISTANCE: 1.24k; VOLTAGE_CONTINUOUS: 11.14V; DKPN: P1.33KDBCT-ND; MOPN: 667-ERA-3AEB1331V; RESISTANCE: 1.33k; TOLERANCE: 0.1%; VOLTAGE_CONTINUOUS: 11.53V; DKPN: 311-1.50MHRCT-ND; MOPN: 603-RC0603FR-071M5L; RESISTANCE: 1.5M; DKPN: 1712-CPF0603B1R62E1TR-ND; MOPN: 279-CPF0603B1R62E1; RESISTANCE: 1.62; VOLTAGE_CONTINUOUS: 0.51V; VOLTAGE_MAX: 50V; DKPN: 311-1.65KHRCT-ND; MOPN: 603-RC0603FR-071K65L; RESISTANCE: 1.65k; VOLTAGE_CONTINUOUS: 12.85V; DKPN: 311-10.0HRCT-ND; MOPN: 603-RC0603FR-0710RL; RESISTANCE: 10; VOLTAGE_CONTINUOUS: 1.00V; DKPN: P10.2KDBCT-ND; MOPN: 667-ERA-3AEB1022V; RESISTANCE: 10.2k; VOLTAGE_CONTINUOUS: 31.94V; DKPN: P10.5KDBCT-ND; MOPN: 677-ERA-3AEB1052V; RESISTANCE: 10.5k; VOLTAGE_CONTINUOUS: 32.40V; DKPN: 311-100HRCT-ND; MOPN: 603-RC0603FR-07100RL; RESISTANCE: 100; VOLTAGE_CONTINUOUS: 3.16V; DKPN: 311-100KHRTR-ND; MOPN: 603-RC0603FR-07100KL; RESISTANCE: 100k; DKPN: P10KBDCT-ND; MOPN: 667-ERA-3ARB103V; RESISTANCE: 10k; VOLTAGE_CONTINUOUS: 31.62V; DKPN: P11.3KDBCT-ND; MOPN: 667-ERA-3AEB1132V; RESISTANCE: 11.3k; VOLTAGE_CONTINUOUS: 33.62V; DKPN: P11.5KDBCT-ND; MOPN: 667-ERA-3AEB1152V; RESISTANCE: 11.5k; VOLTAGE_CONTINUOUS: 33.91V; DKPN: P20096CT-ND; MOPN: 667-ERJ-PB3B1242V; POWER: 0.2W; RESISTANCE: 12.4k; VOLTAGE_CONTINUOUS: 49.79V; DKPN: P120DBCT-ND; MOPN: 667-ERA-3AEB121V; RESISTANCE: 120; VOLTAGE_CONTINUOUS: 3.46V; DKPN: 311-12.0KHRCT-ND; MOPN: 603-RC0603FR-0712KL; RESISTANCE: 12k; VOLTAGE_CONTINUOUS: 34.64V; DKPN: P122724CT-ND; MOPN: 667-ERJ-1GNF13R0C; POWER: 0.05W; RESISTANCE: 13; VOLTAGE_CONTINUOUS: 25V; DKPN: P20099TR-ND; MOPN: 667-ERJ-PB3B1332V; RESISTANCE: 13.3k; VOLTAGE_CONTINUOUS: 51.58V; VOLTAGE_MAX: 75k; DKPN: P13KBECT-ND; MOPN: 667-ERA-3ARW133V; RESISTANCE: 13k; TOLERANCE: 0.05%; DKPN: RT0603BRB0714KL-ND; MOPN: 603-RT0603BRB0714KL; RESISTANCE: 14k; VOLTAGE_CONTINUOUS: 37.4V; DKPN: 541-15.0STR-ND; MOPN: 71-CRCW060315R0FKEAH; RESISTANCE: 15; VOLTAGE_CONTINUOUS: 2.22V; DKPN: P150KDBCT-ND; MOPN: 667-ERA-3AEB154V; RESISTANCE: 150k; DKPN: P154KDBCT-ND; MOPN: 667-ERA-3AEB1543V; RESISTANCE: 154k; DKPN: P15KBDCT-ND; MOPN: 667-ERA-3ARB153V; RESISTANCE: 15k; VOLTAGE_CONTINUOUS: 38.73V; DKPN: 311-17.8KHRCT-ND; MOPN: 603-RC0603FR-0717K8L; RESISTANCE: 17.8k; VOLTAGE_CONTINUOUS: 42.19V; DKPN: 311-18.7KHRCT-ND; MOPN: 603-RC0603FR-0718K7L; RESISTANCE: 18.7k; VOLTAGE_CONTINUOUS: 43.24V; DKPN: 311-180HRCT-ND; MOPN: 603-RC0603FR-07180RL; RESISTANCE: 180; VOLTAGE_CONTINUOUS: 4.24V; DKPN: 1712-CPF-A-0603B1K0ETR-ND; MOPN: 279-CPF-A-0603B1K0E; POWER: 0.0625W; RESISTANCE: 1k; VOLTAGE_CONTINUOUS: 7.9V; DKPN: 311-1.00MHRCT-ND; MOPN: 603-RC0603FR-071ML; RESISTANCE: 1M; DKPN: 13-RT0805BRD072K18LTR-ND; MOPN: 603-RT0805BRD072K18L; POWER: 0.125W; RESISTANCE: 2.18k; VOLTAGE_CONTINUOUS: 16.51V; DKPN: 311-2.55KHRCT-ND; MOPN: 603-RC0603FR-072K55L; RESISTANCE: 2.55k; VOLTAGE_CONTINUOUS: 15.97V; DKPN: P20020CT-ND; MOPN: 667-ERJ-PB3B2741V; RESISTANCE: 2.74k; VOLTAGE_CONTINUOUS: 23.41V; DKPN: 311-20.0KHRTR-ND; MOPN: 603-RC0603FR-0720KL; POWER: 0.1 W; RESISTANCE: 20k; VOLTAGE_CONTINUOUS: 44.72V; DKPN: P19892CT-ND; MOPN: 667-ERJ-PB3B2100V; RESISTANCE: 210; VOLTAGE_CONTINUOUS: 6.48V; DKPN: P215KDBCT-ND; MOPN: 667-ERA-3AEB2153V; RESISTANCE: 215k; DKPN: 311-22.0HRCT-ND; MOPN: 603-RC0603FR-0722RL; RESISTANCE: 22; VOLTAGE_CONTINUOUS: 1.48V; DKPN: P22.1KDBCT-ND; MOPN: 667-ERA-3AEB2212V; RESISTANCE: 22.1k; VOLTAGE_CONTINUOUS: 47.01V; DKPN: 311-240HRCT-ND; MOPN: 603-RC0603FR-07240RL; RESISTANCE: 240; VOLTAGE_CONTINUOUS: 4.90V; DKPN: P255KDBCT-ND; MOPN: 667-ERA-3AEB2553V; RESISTANCE: 255k; DKPN: 10-ERJ-UP3F2001VTR-ND; MOPN: 667-ERJ-UP3F2001V; POWER: 0.25W; RESISTANCE: 2k; VOLTAGE_CONTINUOUS: 22.36V; DKPN: P3.3AJTR-ND; MOPN: 667-ERJ-3RQF3R3V; RESISTANCE: 3.3; VOLTAGE_CONTINUOUS: 0.57V; DKPN: YAG1651TR-ND; MOPN: 603-RT0603BRD073K32L; RESISTANCE: 3.32k; VOLTAGE_CONTINUOUS: 18.22V; DKPN: P20340TR-ND; MOPN: 667-ERJ-PB3D3301V; POWER: 0.3W; RESISTANCE: 3.3k; TOLERANCE: 0.5%; VOLTAGE_CONTINUOUS: 25.69V; VOLTAGE_MAX: 150; DKPN: 311-3.90KHRCT-ND; MOPN: 603-RC0603FR-073K9L; RESISTANCE: 3.9k; VOLTAGE_CONTINUOUS: 19.75V; DKPN: P20140CT-ND; MOPN: 667-ERJ-PB3B3092V; RESISTANCE: 30.9k; VOLTAGE_MAX: 200V; DKPN: P30KBDCT-ND; MOPN: 667-ERA-3ARB303V; RESISTANCE: 30k; VOLTAGE_CONTINUOUS: 54.77V; DKPN: P20144TR-ND; MOPN: 667-ERJ-PB3B3322V; RESISTANCE: 33.2k; VOLTAGE_CONTINUOUS: 57.61V; DKPN: P330KDBCT-ND; MOPN: 667-ERA-3AEB334V; RESISTANCE: 330k; DKPN: RHM33KAYTR-ND; MOPN: 755-KTR03EZPF3302; RESISTANCE: 33k; VOLTAGE_CONTINUOUS: 57.44V; VOLTAGE_MAX: 350V; DKPN: 311-36.5KHRCT-ND; MOPN: 603-RC0603FR-0736K5L; RESISTANCE: 36.5k; VOLTAGE_CONTINUOUS: 60.42V; DKPN: 311-360HRTR-ND; MOPN: 603-RC0603FR-07360RL; RESISTANCE: 360; VOLTAGE_CONTINUOUS: 6.00V; DKPN: RHM360KAYTR-ND; MOPN: 755-KTR03EZPF3603; RESISTANCE: 360k; VOLTAGE_CONTINUOUS: 189.74V; DKPN: 311-374KHRCT-ND; MOPN: 603-RC0603FR-07374KL; RESISTANCE: 374k; DKPN: 13-RT0603BRD0739RLTR-ND; MOPN: 603-RT0603BRD0739RL; RESISTANCE: 39; VOLTAGE_CONTINUOUS: 1.97V; DKPN: P4.12KDBCT-ND; MOPN: 667-ERA-3AEB4121V; RESISTANCE: 4.12k; VOLTAGE_CONTINUOUS: 20.30V; DKPN: 311-4.64KHRCT-ND; MOPN: 603-RC0603FR-074K64L; RESISTANCE: 4.64k; VOLTAGE_CONTINUOUS: 21.54V; DKPN: 311-402HRCT-ND; MOPN: 603-RC0603FR-07402RL; RESISTANCE: 402; VOLTAGE_CONTINUOUS: 6.34V; DKPN: P123000CT-ND; MOPN: 667-ERJ-1GNF41R2C; RESISTANCE: 41.2; DKPN: P20155CT-ND; MOPN: 667-ERJ-PB3B4122V; RESISTANCE: 41.2k; DKPN: 311-43.0KHRCT-ND; MOPN: 603-RC0603FR-0743KL; RESISTANCE: 43k; VOLTAGE_CONTINUOUS: 65.57V; DKPN: P470BYCT-ND; MOPN: 667-ERJ-PA3F4700V; RESISTANCE: 470; VOLTAGE_CONTINUOUS: 10.84V; DKPN: P16039TR-ND; MOPN: 667-ERJ-P03J5R1V; RESISTANCE: 5.1; VOLTAGE_CONTINUOUS: 1.13V; DKPN: 311-5.10KHRTR-ND; MOPN: 603-RC0603FR-075K1L; RESISTANCE: 5.1k; VOLTAGE_CONTINUOUS: 22.58V; DKPN: A124665CT-ND; MOPN: 279-RN73C1J5R49BTD; RESISTANCE: 5.49; DKPN: P20367CT-ND; MOPN: 667-ERJ-PB3D5491V; RESISTANCE: 5.49k; DKPN: P5.9KDBCT-ND; MOPN: 667-ERA-3AEB5901V; RESISTANCE: 5.9k; VOLTAGE_CONTINUOUS: 24.29V; DKPN: 13-RT0603BRE0750RLCT-ND; MOPN: 603-RT0603BRE0750RL; RESISTANCE: 50; VOLTAGE_CONTINUOUS: 2.24V; DKPN: RHM510KAYTR-ND; MOPN: 755-KTR03EZPF5103; RESISTANCE: 510k; VOLTAGE_CONTINUOUS: 225.83V; DKPN: 311-60.4HRCT-ND; MOPN: 603-RC0603FR-0760R4L; RESISTANCE: 60.4; VOLTAGE_CONTINUOUS: 2.48V; DKPN: 311-620HRCT-ND; MOPN: 603-RC0603FR-07620RL; RESISTANCE: 620; VOLTAGE_CONTINUOUS: 7.87V; DKPN: P73.2KDBCT-ND; MOPN: 667-ERA-3AEB7322V; RESISTANCE: 73.2k; DKPN: RT0603BRE0775KL-ND; MOPN: 603-RT0603BRE0775KL; DKPN: 764-1461-2-ND; MOPN: 71-PTN0603E8351BST1; POWER: 0.15W; RESISTANCE: 8.35k; VOLTAGE_CONTINUOUS: 28.90V; DKPN: YAG4603TR-ND; MOPN: 603-RT0603BRD078K66L; RESISTANCE: 8.66k; VOLTAGE_CONTINUOUS: 29.43V; DKPN: P84.5KDBCT-ND; MOPN: 667-ERA-3AEB8452V; RESISTANCE: 84.5k; DKPN: P20197CT-ND; MOPN: 667-ERJ-PB3B9312V; RESISTANCE: 93.1k; VOLTAGE_CONTINUOUS: 136V; RESISTANCE: DNP; DKPN: RHM3.3KAYTR-ND; MOPN: 755-KTR03EZPF3301; VOLTAGE_CONTINUOUS: 18.17V; DKPN: RHM75KAYTR-ND; MOPN: 755-KTR03EZPF7502; RESISTANCE: 750k; VOLTAGE_CONTINUOUS: 273.86V; DKPN: RHM750KAYTR-ND; MOPN: 755-KTR03EZPF7503; VOLTAGE_CONTINUOUS: 86.60V; SymbolName_1: RESISTOR; LibraryName: HyTechDevices; DeviceSetName: RESISTOR_?_*; Package: 0603-RES; VOLTAGE_MAX: 75V; MANUFACTURER: YAGEO; VOLTAGE_CONTINUOUS: 150V; VOLTAGE_CONTINUOUS: 50V; RESISTANCE: 75k